# Altium schematic sheet Sensors.SchDoc
size A4; SheetNumber: 2; SheetTotal: 2
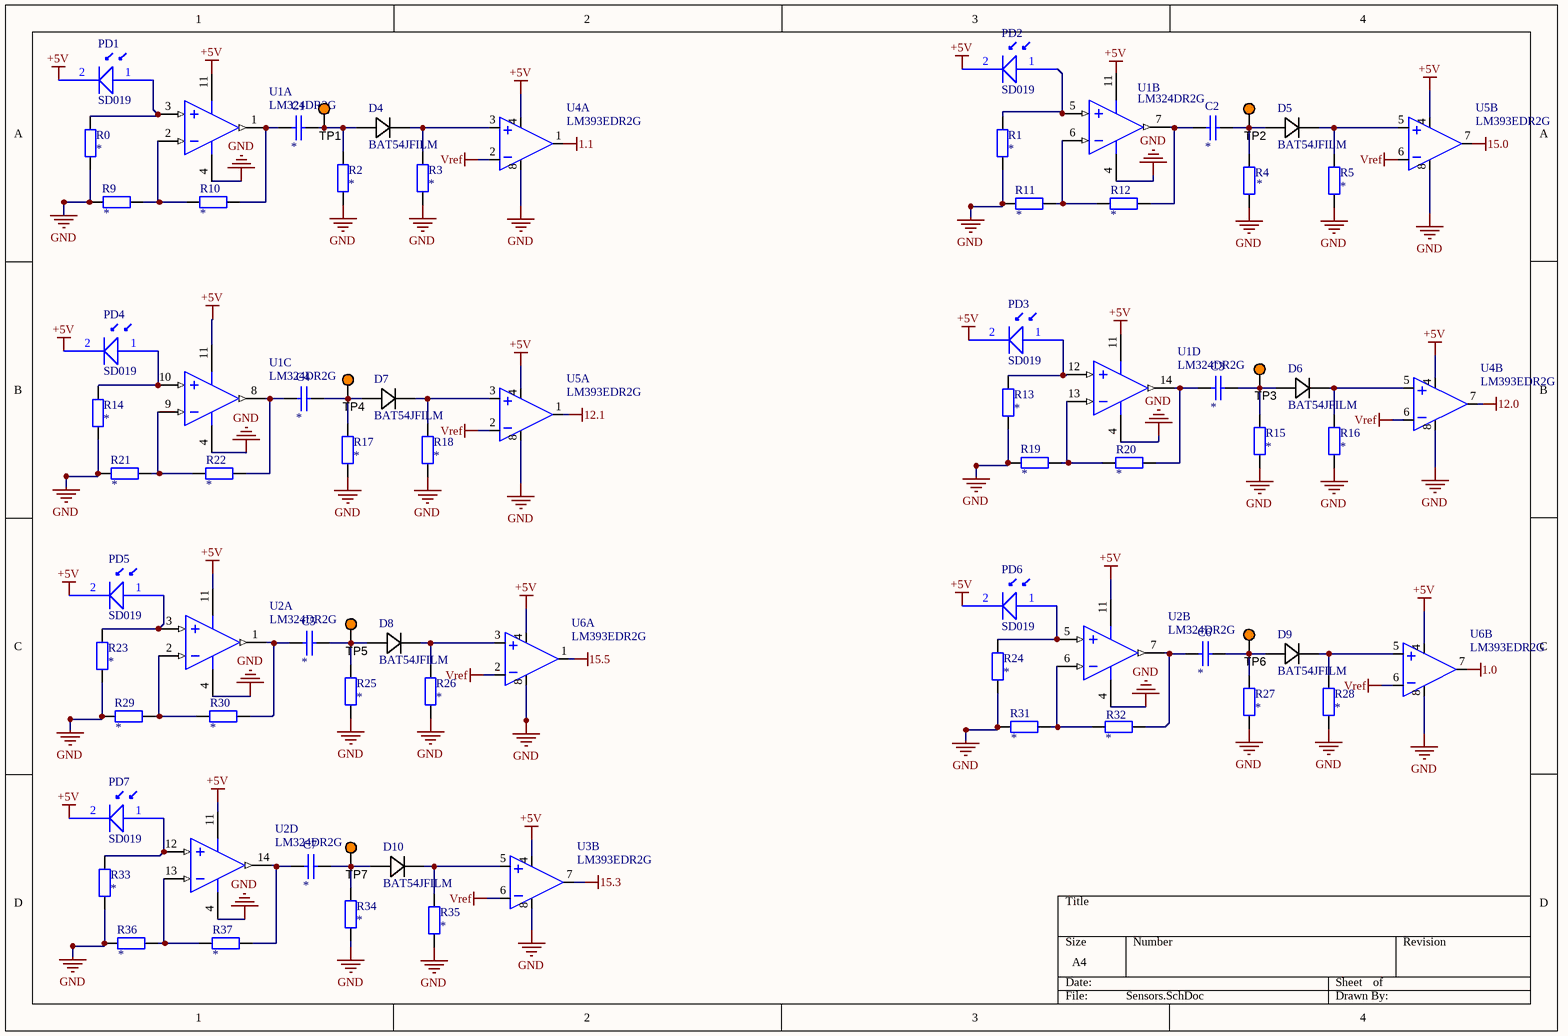
[diagram p0: Sensors.SchDoc]

## Parts
C1  *  [0805 CAP]
C2  *  [0805 CAP]
C3  *  [0805 CAP]
C4  *  [0805 CAP]
C5  *  [0805 CAP]
C6  *  [0805 CAP]
C7  *  [0805 CAP]
D4  BAT54JFILM  [CR_SOD323_BAT54_STM]
D5  BAT54JFILM  [CR_SOD323_BAT54_STM]
D6  BAT54JFILM  [CR_SOD323_BAT54_STM]
D7  BAT54JFILM  [CR_SOD323_BAT54_STM]
D8  BAT54JFILM  [CR_SOD323_BAT54_STM]
D9  BAT54JFILM  [CR_SOD323_BAT54_STM]
D10  BAT54JFILM  [CR_SOD323_BAT54_STM]
PD1  SD019  [SD019]
PD2  SD019  [SD019]
PD3  SD019  [SD019]
PD4  SD019  [SD019]
PD5  SD019  [SD019]
PD6  SD019  [SD019]
PD7  SD019  [SD019]
R0  *  [0805 RES]
R1  *  [0805 RES]
R2  *  [0805 RES]
R3  *  [0805 RES]
R4  *  [0805 RES]
R5  *  [0805 RES]
R9  *  [0805 RES]
R10  *  [0805 RES]
R11  *  [0805 RES]
R12  *  [0805 RES]
R13  *  [0805 RES]
R14  *  [0805 RES]
R15  *  [0805 RES]
R16  *  [0805 RES]
R17  *  [0805 RES]
R18  *  [0805 RES]
R19  *  [0805 RES]
R20  *  [0805 RES]
R21  *  [0805 RES]
R22  *  [0805 RES]
R23  *  [0805 RES]
R24  *  [0805 RES]
R25  *  [0805 RES]
R26  *  [0805 RES]
R27  *  [0805 RES]
R28  *  [0805 RES]
R29  *  [0805 RES]
R30  *  [0805 RES]
R31  *  [0805 RES]
R32  *  [0805 RES]
R33  *  [0805 RES]
R34  *  [0805 RES]
R35  *  [0805 RES]
R36  *  [0805 RES]
R37  *  [0805 RES]
TP1  5003  [TP_TH]  (value not drawn)
TP2  5003  [TP_TH]  (value not drawn)
TP3  5003  [TP_TH]  (value not drawn)
TP4  5003  [TP_TH]  (value not drawn)
TP5  5003  [TP_TH]  (value not drawn)
TP6  5003  [TP_TH]  (value not drawn)
TP7  5003  [TP_TH]  (value not drawn)
U1  LM324DR2G  [SOIC-14]  (parts A,B,C,D of 4)
U2  LM324DR2G  [SOIC-14]  (parts A,B,D of 4)
U3  LM393EDR2G  [SOIC8_4X5_ONS]  (part B of 2)
U4  LM393EDR2G  [SOIC8_4X5_ONS]  (parts A,B of 2)
U5  LM393EDR2G  [SOIC8_4X5_ONS]  (parts A,B of 2)
U6  LM393EDR2G  [SOIC8_4X5_ONS]  (parts A,B of 2)

## Nets
1.0: U6.7
1.1: U4.1
12.0: U4.7
12.1: U5.1
15.0: U5.7
15.3: U3.7
15.5: U6.1
+5V: PD1.2 PD2.2 PD3.2 PD4.2 PD5.2 PD6.2 PD7.2 U1.11(VEE/GND) U2.11(VEE/GND) U3.4 U4.4 U5.4 U6.4
GND: R0.1 R1.1 R2.1 R3.1 R4.1 R5.1 R9.2 R11.2 R13.1 R14.1 R15.1 R16.1 R17.1 R18.1 R19.2 R21.2 R23.1 R24.1 R25.1 R26.1 R27.1 R28.1 R29.2 R31.2 R33.1 R34.1 R35.1 R36.2 U1.4(VCC) U2.4(VCC) U3.8 U4.8 U5.8 U6.8
Vref: U3.6 U4.2 U4.6 U5.2 U5.6 U6.2 U6.6
NetC1_1: C1.1 R10.2 U1.1(OUT1)
NetC1_2: C1.2 D4.1 R2.2 TP1.1
NetC2_1: C2.1 R12.2 U1.7(OUT2)
NetC2_2: C2.2 D5.1 R4.2 TP2.1
NetC3_1: C3.1 R20.2 U1.14(OUT4)
NetC3_2: C3.2 D6.1 R15.2 TP3.1
NetC4_1: C4.1 R22.2 U1.8(OUT3)
NetC4_2: C4.2 D7.1 R17.2 TP4.1
NetC5_1: C5.1 R30.2 U2.1(OUT1)
NetC5_2: C5.2 D8.1 R25.2 TP5.1
NetC6_1: C6.1 R32.2 U2.7(OUT2)
NetC6_2: C6.2 D9.1 R27.2 TP6.1
NetC7_1: C7.1 R37.2 U2.14(OUT4)
NetC7_2: C7.2 D10.1 R34.2 TP7.1
NetD4_2: D4.2 R3.2 U4.3
NetD5_2: D5.2 R5.2 U5.5
NetD6_2: D6.2 R16.2 U4.5
NetD7_2: D7.2 R18.2 U5.3
NetD8_2: D8.2 R26.2 U6.3
NetD9_2: D9.2 R28.2 U6.5
NetD10_2: D10.2 R35.2 U3.5
NetPD1_1: PD1.1 R0.2 U1.3(IN1+)
NetPD2_1: PD2.1 R1.2 U1.5(IN2+)
NetPD3_1: PD3.1 R13.2 U1.12(IN4+)
NetPD4_1: PD4.1 R14.2 U1.10(IN3+)
NetPD5_1: PD5.1 R23.2 U2.3(IN1+)
NetPD6_1: PD6.1 R24.2 U2.5(IN2+)
NetPD7_1: PD7.1 R33.2 U2.12(IN4+)
NetR9_1: R9.1 R10.1 U1.2(IN1-)
NetR11_1: R11.1 R12.1 U1.6(IN2-)
NetR19_1: R19.1 R20.1 U1.13(IN4-)
NetR21_1: R21.1 R22.1 U1.9(IN3-)
NetR29_1: R29.1 R30.1 U2.2(IN1-)
NetR31_1: R31.1 R32.1 U2.6(IN2-)
NetR36_1: R36.1 R37.1 U2.13(IN4-)

## Notes on the sheet
- Labels drawn without touching a wire or pin: +5V

## Library data of the parts
C1-C7 = CerCap_SMT_0805: SMT ceramic capacitor 0805 size; Value: *
D4-D10 = BAT54JFILM: No Description Available; Mfr_Name: STMicroelectronics
R0-R5 R9-R37 = Res_SMT_0805: 0805 resistor; Published: 8-Jun-2000; LatestRevisionDate: 17-Jul-2002; LatestRevisionNote: Re-released for DXP Platform.; PackageReference: AXIAL-0.4; Publisher: Altium Limited; Value: *; ComponentLink1Description: https://nz.mouser.com/datasheet/2/315/AOA0000C304-1149620.pdf
TP1-TP7 = TestPoint: Test Point, Orange, 1-Pin THD, RoHS; Peak Reverse Current: 600 uA; Forward Current: 3 A; Max Surge Current: 80 A; Forward Voltage: 1.08 V; Max Operating Temperature: 150 degC; PackageReference: 5003; Pins: 2; ComponentLink2URL: http://keyelco.com/userAssets/file/M65p56.pdf; PackageDescription: 1-Pin Through Hole Device, Dia 2.54 mm; Weight: 0.01 lb; Diameter: 5.3 mm; Mount: Through Hole; Package Quantity: 500; Packaging: Bulk; Min Operating Temperature: -65 degC; ComponentLink1Description: Manufacturer URL; Height: 0.25 inch; ComponentLink1URL: http://www.keyelco.com/; ComponentLink2Description: Datasheet; Width: 0.25 inch; REACH SVHC: No SVHC; RoHSCompliant: true; Radiation Hardening: No; Length: 9.5 mm; DatasheetVersion: Jun-15
U1 U2 = LM324DR_SMT_SOIC16: Single Supply Quad Operational Amplifier, 3 to 32 V, 0 to 70 degC, 14-Pin SOIC, Pb-Free, Tape and Reel; Manufacturer: On Semiconductor; VCC Max (V): 32; VCC Min (V): 3; PackageVersion: Rev. K, 05/2011; ComponentLink3URL: http://www.onsemi.com/pub_link/Collateral/751A-03.PDF; ComponentLink3Description: Package Specification; Packing: Tape and Reel; ComponentLink2URL: http://www.onsemi.cn/pub_link/Collateral/LM324-D.PDF; PackageReference: SOIC-14-751A-03; ComponentLink1URL: http://www.onsemi.com/; PackageDescription: 14-Pin Small Outline Integrated Circuit, Body 8.65 x 3.9 mm, Pitch 1.27 mm; ComponentLink1Description: Manufacturer URL; DatasheetVersion: Rev. 25; Mounting Technology: Surface Mount; RoHS: TRUE; ComponentLink2Description: Datasheet; PartNumber: LM324DR2G